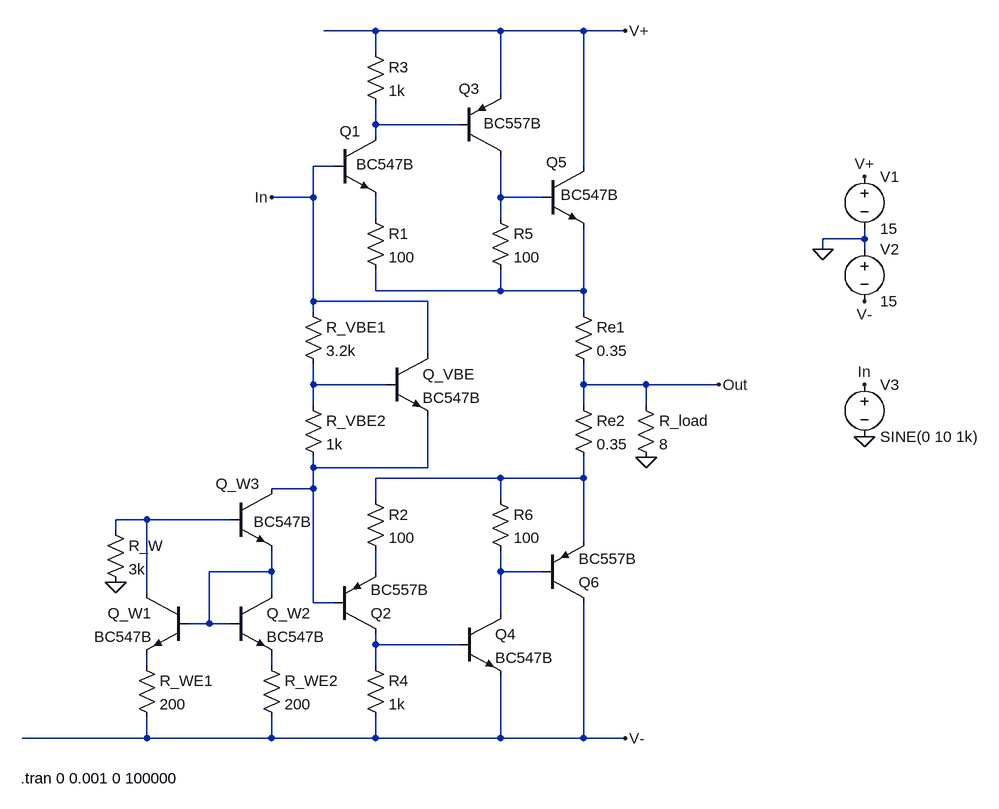
[diagram p0: schematic classBAmplifierWIP.asc]
classBAmplifierWIP.asc, the LTspice schematic file:
Version 4
SHEET 1 1056 1168
WIRE 112 0 32 0
WIRE 304 0 112 0
WIRE 432 0 304 0
WIRE 496 0 432 0
WIRE 112 32 112 0
WIRE 304 96 304 0
WIRE 112 144 112 112
WIRE 240 144 112 144
WIRE 112 160 112 144
WIRE 48 208 16 208
WIRE 432 208 432 0
WIRE 16 256 16 208
WIRE 16 256 -48 256
WIRE 304 256 304 192
WIRE 368 256 304 256
WIRE 112 288 112 256
WIRE 304 288 304 256
WIRE 864 320 864 304
WIRE 864 320 800 320
WIRE 800 336 800 320
WIRE 864 336 864 320
WIRE 112 400 112 368
WIRE 304 400 304 368
WIRE 304 400 112 400
WIRE 432 400 432 304
WIRE 432 400 304 400
WIRE 16 416 16 256
WIRE 192 416 16 416
WIRE 16 432 16 416
WIRE 432 432 432 400
WIRE 192 496 192 416
WIRE 16 544 16 512
WIRE 128 544 16 544
WIRE 432 544 432 512
WIRE 528 544 432 544
WIRE 640 544 528 544
WIRE 16 576 16 544
WIRE 432 576 432 544
WIRE 528 576 528 544
WIRE 16 672 16 656
WIRE 192 672 192 592
WIRE 192 672 16 672
WIRE 304 688 112 688
WIRE 432 688 432 656
WIRE 432 688 304 688
WIRE 16 704 16 672
WIRE 16 704 -48 704
WIRE 112 720 112 688
WIRE 304 720 304 688
WIRE -240 752 -288 752
WIRE -112 752 -240 752
WIRE -288 768 -288 752
WIRE 432 784 432 688
WIRE -48 832 -48 800
WIRE -48 832 -144 832
WIRE 112 832 112 800
WIRE 304 832 304 800
WIRE 368 832 304 832
WIRE -240 864 -240 752
WIRE -48 864 -48 832
WIRE 16 880 16 704
WIRE 48 880 16 880
WIRE 304 896 304 832
WIRE -144 912 -144 832
WIRE -144 912 -176 912
WIRE -112 912 -144 912
WIRE 112 944 112 928
WIRE 240 944 112 944
WIRE -240 976 -240 960
WIRE -48 976 -48 960
WIRE 112 976 112 944
WIRE -240 1088 -240 1056
WIRE -240 1088 -432 1088
WIRE -48 1088 -48 1056
WIRE -48 1088 -240 1088
WIRE 112 1088 112 1056
WIRE 112 1088 -48 1088
WIRE 304 1088 304 992
WIRE 304 1088 112 1088
WIRE 432 1088 432 880
WIRE 432 1088 304 1088
WIRE 496 1088 432 1088
FLAG 496 0 V+
FLAG 640 544 Out
FLAG 496 1088 V-
FLAG 800 336 0
FLAG 864 224 V+
FLAG 864 416 V-
FLAG -48 256 In
FLAG -288 848 0
FLAG 864 624 0
FLAG 864 544 In
FLAG 528 656 0
SYMBOL res 96 16 R0
SYMATTR InstName R3
SYMATTR Value 1k
SYMBOL npn 48 160 R0
WINDOW 0 9 -6 Left 2
WINDOW 3 34 45 Left 2
SYMATTR InstName Q1
SYMATTR Value BC547B
SYMBOL res 96 272 R0
SYMATTR InstName R1
SYMATTR Value 100
SYMBOL pnp 240 192 M180
WINDOW 0 0 103 Left 2
WINDOW 3 38 50 Left 2
SYMATTR InstName Q3
SYMATTR Value BC557B
SYMBOL res 288 272 R0
SYMATTR InstName R5
SYMATTR Value 100
SYMBOL npn 368 208 R0
WINDOW 0 6 -6 Left 2
WINDOW 3 29 44 Left 2
SYMATTR InstName Q5
SYMATTR Value BC547B
SYMBOL res 416 416 R0
SYMATTR InstName Re1
SYMATTR Value 0.35
SYMBOL res 416 560 R0
SYMATTR InstName Re2
SYMATTR Value 0.35
SYMBOL res 96 704 R0
SYMATTR InstName R2
SYMATTR Value 100
SYMBOL pnp 48 928 M180
SYMATTR InstName Q2
SYMATTR Value BC557B
SYMBOL res 96 960 R0
SYMATTR InstName R4
SYMATTR Value 1k
SYMBOL npn 240 896 R0
SYMATTR InstName Q4
SYMATTR Value BC547B
SYMBOL res 288 704 R0
SYMATTR InstName R6
SYMATTR Value 100
SYMBOL pnp 368 880 M180
SYMATTR InstName Q6
SYMATTR Value BC557B
SYMBOL voltage 864 208 R0
WINDOW 123 0 0 Left 0
WINDOW 39 0 0 Left 0
SYMATTR InstName V1
SYMATTR Value 15
SYMBOL voltage 864 320 R0
WINDOW 123 0 0 Left 0
WINDOW 39 0 0 Left 0
SYMATTR InstName V2
SYMATTR Value 15
SYMBOL res 0 416 R0
SYMATTR InstName R_VBE1
SYMATTR Value 3.2k
SYMBOL res 0 560 R0
SYMATTR InstName R_VBE2
SYMATTR Value 1k
SYMBOL npn 128 496 R0
SYMATTR InstName Q_VBE
SYMATTR Value BC547B
SYMBOL npn -112 704 R0
WINDOW 0 -22 -7 Left 2
WINDOW 3 36 51 Left 2
SYMATTR InstName Q_W3
SYMATTR Value BC547B
SYMBOL npn -112 864 R0
SYMATTR InstName Q_W2
SYMATTR Value BC547B
SYMBOL res -64 960 R0
SYMATTR InstName R_WE2
SYMATTR Value 200
SYMBOL npn -176 864 M0
SYMATTR InstName Q_W1
SYMATTR Value BC547B
SYMBOL res -304 752 R0
SYMATTR InstName R_W
SYMATTR Value 3k
SYMBOL res -256 960 R0
SYMATTR InstName R_WE1
SYMATTR Value 200
SYMBOL voltage 864 528 R0
WINDOW 123 0 0 Left 0
WINDOW 39 0 0 Left 0
SYMATTR InstName V3
SYMATTR Value SINE(0 10 1k)
SYMBOL res 512 560 R0
SYMATTR InstName R_load
SYMATTR Value 8
TEXT -434 1150 Left 2 !.tran 0 0.001 0 100000

The netlist it stands for:
* classBAmplifierWIP.asc
R3 V+ N001 1k
Q1 N001 In N003 0 BC547B
R1 N003 N004 100
Q3 N002 N001 V+ 0 BC557B
R5 N002 N004 100
Q5 V+ N002 N004 0 BC547B
Re1 N004 Out 0.35
Re2 Out N007 0.35
R2 N007 N010 100
Q2 N012 N006 N010 0 BC557B
R4 N012 V- 1k
Q4 N011 N012 V- 0 BC547B
R6 N007 N011 100
Q6 V- N011 N007 0 BC557B
V1 V+ 0 15
V2 0 V- 15
R_VBE1 In N005 3.2k
R_VBE2 N005 N006 1k
Q_VBE In N005 N006 0 BC547B
Q_W3 N006 N008 N009 0 BC547B
Q_W2 N009 N009 N014 0 BC547B
R_WE2 N014 V- 200
Q_W1 N008 N009 N013 0 BC547B
R_W N008 0 3k
R_WE1 N013 V- 200
V3 In 0 SINE(0 10 1k)
R_load Out 0 8
.model NPN NPN
.model PNP PNP
.lib standard.bjt
.tran 0 0.001 0 100000
.backanno
.end